# Altium schematic sheet Main.SchDoc
size A4 portrait; SheetNumber: 1; SheetTotal: 3
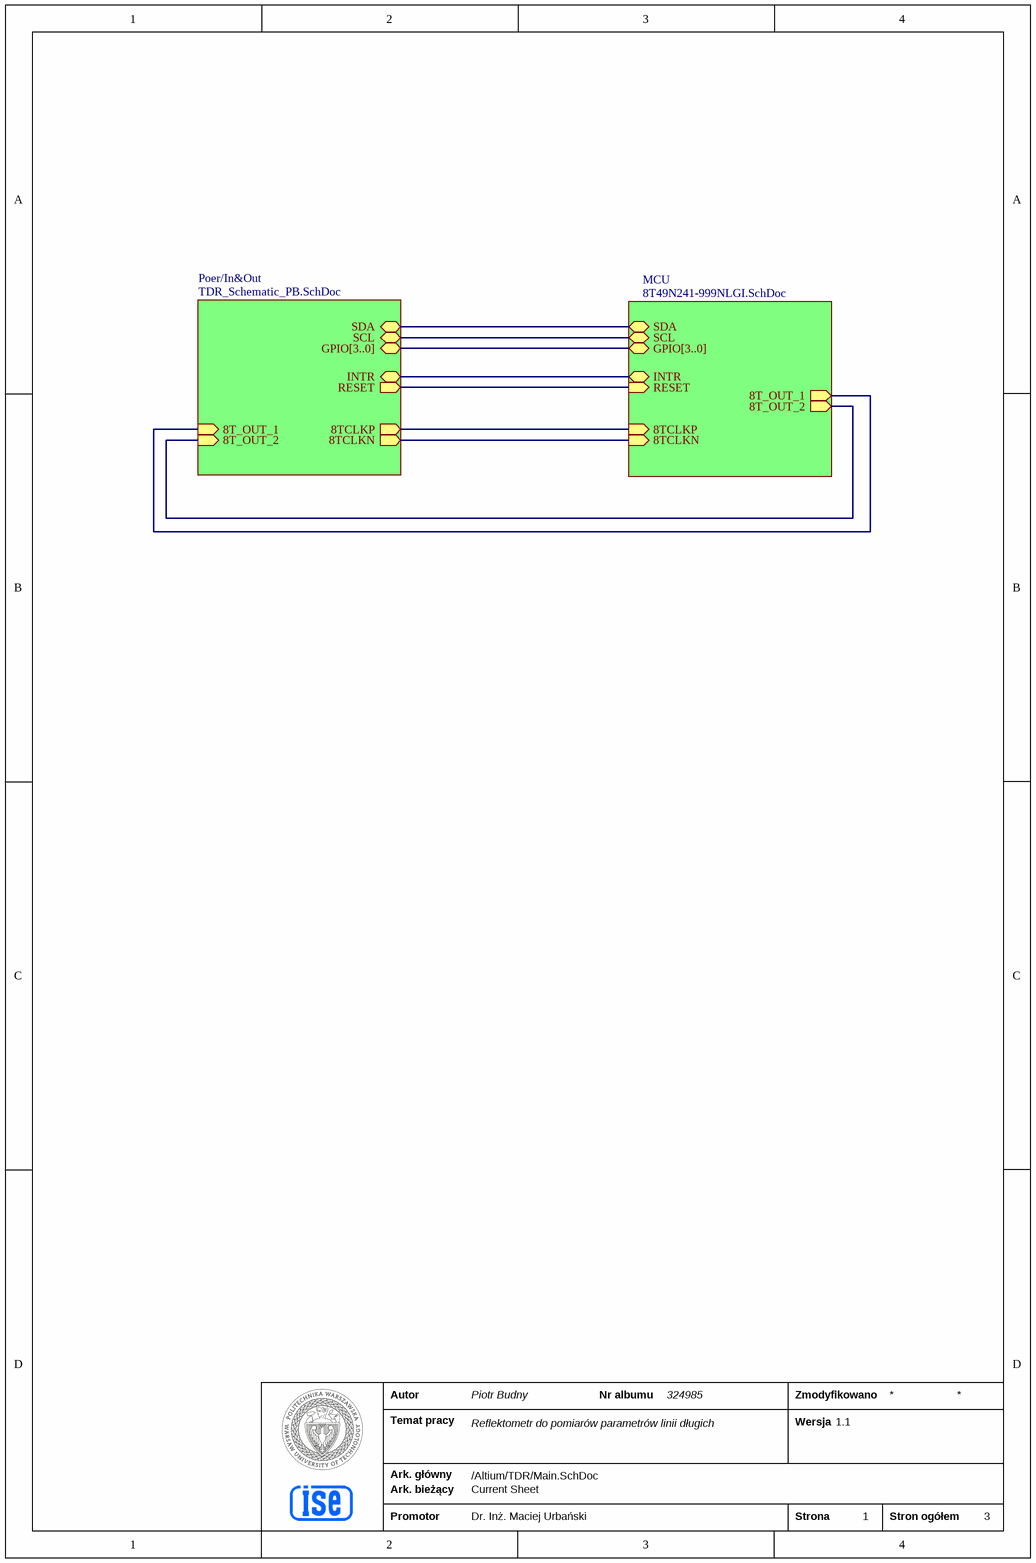
[diagram p0: Main.SchDoc]

## Sub-sheets
MCU = 8T49N241-999NLGI.SchDoc: SDA (bidir), SCL (bidir), GPIO[3..0] (bidir), RESET (in), 8TCLKP (in), 8TCLKN (in), 8T_OUT_1 (out), 8T_OUT_2 (out), INTR (bidir)
Poer/In&Out = TDR_Schematic_PB.SchDoc: SDA (bidir), SCL (bidir), GPIO[3..0] (bidir), INTR (bidir), RESET (out), 8T_OUT_1 (in), 8T_OUT_2 (in), 8TCLKP (out), 8TCLKN (out)

## Nets
(unnamed): sheet Poer/In&Out/SDA, sheet MCU/SDA
(unnamed): sheet Poer/In&Out/SCL, sheet MCU/SCL
(unnamed): sheet Poer/In&Out/INTR, sheet MCU/INTR
(unnamed): sheet Poer/In&Out/RESET, sheet MCU/RESET
(unnamed): sheet Poer/In&Out/8T_OUT_1, sheet MCU/8T_OUT_1
(unnamed): sheet Poer/In&Out/8T_OUT_2, sheet MCU/8T_OUT_2
(unnamed): sheet Poer/In&Out/8TCLKP, sheet MCU/8TCLKP
(unnamed): sheet Poer/In&Out/8TCLKN, sheet MCU/8TCLKN

## Buses and harness runs
bus sheet MCU/GPIO[3..0] = sheet Poer/In&Out/GPIO[3..0]

## Notes on the sheet
- Autor
- Temat pracy
- Piotr Budny
- Reflektometr do pomiarów parametrów linii długich
- Nr albumu
- 324985
- Zmodyfikowano
- Wersja
- 1.1
- Ark. główny
- Ark. bieżący
- /Altium/TDR/Main.SchDoc
- Current Sheet
- Promotor
- Dr. Inż. Maciej Urbański
- Strona
- Stron ogółem